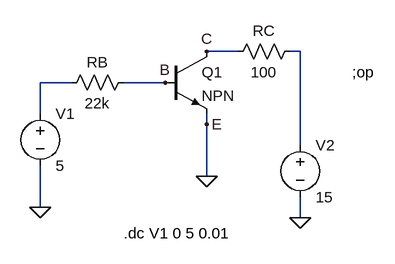
[diagram p0: schematic Draft1.asc]
Draft1.asc, the LTspice schematic file:
Version 4
SHEET 1 880 680
WIRE 368 -16 320 -16
WIRE 464 -16 448 -16
WIRE 112 32 64 32
WIRE 256 32 192 32
WIRE 64 80 64 32
WIRE 320 96 320 80
WIRE 464 128 464 -16
WIRE 320 176 320 96
WIRE 64 224 64 160
WIRE 464 240 464 208
FLAG 320 176 0
FLAG 64 224 0
FLAG 464 240 0
FLAG 256 32 B
FLAG 320 96 E
FLAG 320 -16 C
SYMBOL voltage 64 64 R0
WINDOW 123 0 0 Left 0
WINDOW 39 0 0 Left 0
SYMATTR InstName V1
SYMATTR Value 5
SYMBOL voltage 464 112 R0
WINDOW 123 0 0 Left 0
WINDOW 39 0 0 Left 0
SYMATTR InstName V2
SYMATTR Value 15
SYMBOL res 208 16 R90
WINDOW 0 0 56 VBottom 2
WINDOW 3 32 56 VTop 2
SYMATTR InstName RB
SYMATTR Value 22k
SYMBOL res 464 -32 R90
WINDOW 0 0 56 VBottom 2
WINDOW 3 32 56 VTop 2
SYMATTR InstName RC
SYMATTR Value 100
SYMBOL npn 256 -16 R0
SYMATTR InstName Q1
TEXT 192 264 Left 2 !.dc V1 0 5 0.01
TEXT 544 16 Left 2 !;op

The netlist it stands for:
* Draft1.asc
V1 N002 0 5
V2 N001 0 15
RB B N002 22k
RC N001 C 100
Q1 C B 0 0 NPN
.model NPN NPN
.model PNP PNP
.lib standard.bjt
.dc V1 0 5 0.01
;op
.backanno
.end